# EAGLE design remote (EAGLE 9.1.0)
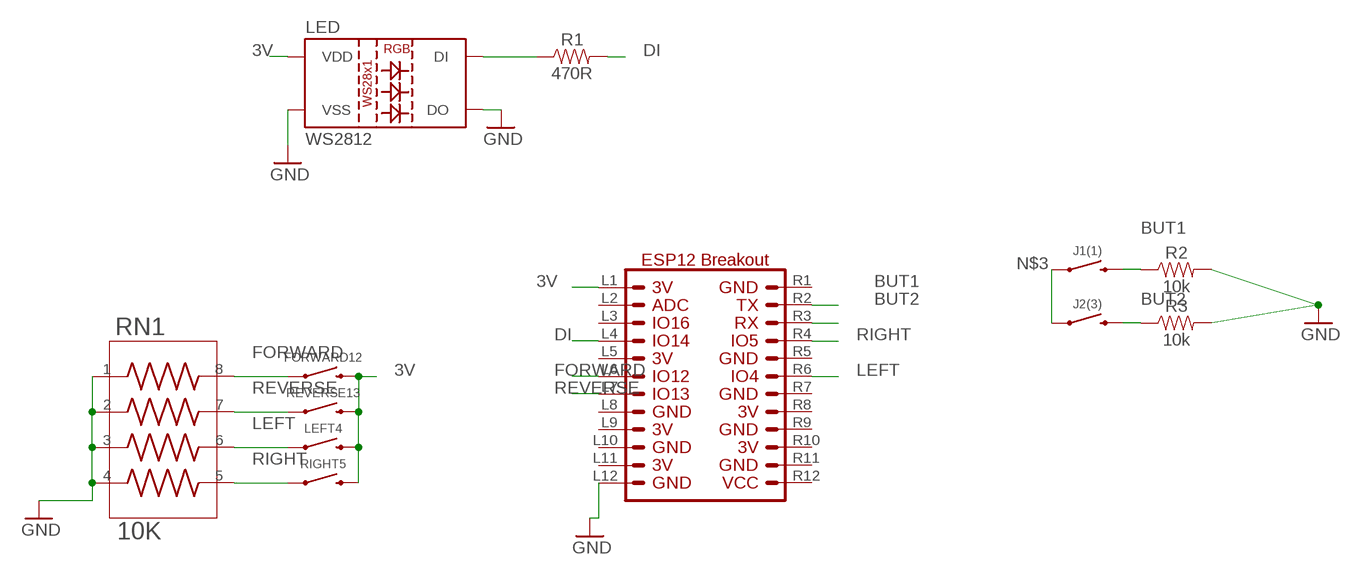
[diagram p0: schematic, sheet 1]

## Parts
FORWARD12  PUSHBUTTON_THD  [TACTILE_SWITCH_PTH_6.0MM]
J1(1)  PUSHBUTTON_THD  [TACTILE_SWITCH_PTH_6.0MM]
J2(3)  PUSHBUTTON_THD  [TACTILE_SWITCH_PTH_6.0MM]
LED  WS2812  [LED-TRICOLOR-5050-IC]
LEFT4  PUSHBUTTON_THD  [TACTILE_SWITCH_PTH_6.0MM]
R1  470R  RESISTOR_1206  [SPARKFUN-RESISTORS_1206]
R2  10k  RESISTOR_1206  [SPARKFUN-RESISTORS_1206]
R3  10k  RESISTOR_1206  [SPARKFUN-RESISTORS_1206]
REVERSE13  PUSHBUTTON_THD  [TACTILE_SWITCH_PTH_6.0MM]
RIGHT5  PUSHBUTTON_THD  [TACTILE_SWITCH_PTH_6.0MM]
RN1  10K  RESISTOR_ARRAY_1206  [RESCAF80P320X160X60-8N]
U$1  ESP12_BREAKOUT  [ESP12_BREAKOUT_CONN]

## Nets
3V: FORWARD12.3 LED.VDD LEFT4.3 REVERSE13.3 RIGHT5.3 U$1.L1
BUT1: J1(1).3 R2.1 U$1.R2
BUT2: J2(3).3 R3.1 U$1.R3
DI: R1.2 U$1.L4
FORWARD: FORWARD12.1 RN1.8 U$1.L6
GND: LED.DOUT(DO) LED.VSS R2.2 R3.2 RN1.1 RN1.2 RN1.3 RN1.4 U$1.L12
LEFT: LEFT4.1 RN1.6 U$1.R6
N$3: J1(1).1 J2(3).1
N$6: LED.DIN(DI) R1.1
REVERSE: REVERSE13.1 RN1.7 U$1.L7
RIGHT: RIGHT5.1 RN1.5 U$1.R4
Unconnected: U$1.L2 U$1.L3 U$1.L5 U$1.L8 U$1.L9 U$1.L10 U$1.L11 U$1.R1 U$1.R5 U$1.R7 U$1.R8 U$1.R9 U$1.R10 U$1.R11 U$1.R12

## Library data of the parts
FORWARD12 J1(1) J2(3) LEFT4 REVERSE13 RIGHT5 = AutoPark:PUSHBUTTON_THD
LED = AutoPark:WS2812
R1-R3 = AutoPark:RESISTOR_1206
RN1 = AutoPark:RESISTOR_ARRAY_1206: Res Thick Film Array 75 Ohm 5% 0.25W(1/4W) ?200ppm/C ISOL Molded 8-Pin 1206(4 X 0603) Convex SMD T/R; AVAILABILITY: Unavailable; DESCRIPTION: Res Thick Film Array 75 Ohm 5% 0.25W_1/4W_ ?200ppm/C ISOL Molded 8-Pin 1206_4 X 0603_ Convex SMD T/R; MF: Bourns; MP: CAY16-750J4LF; PACKAGE: 1206 Bourns; PRICE: None
U$1 = AutoPark:ESP12_BREAKOUT

## Board
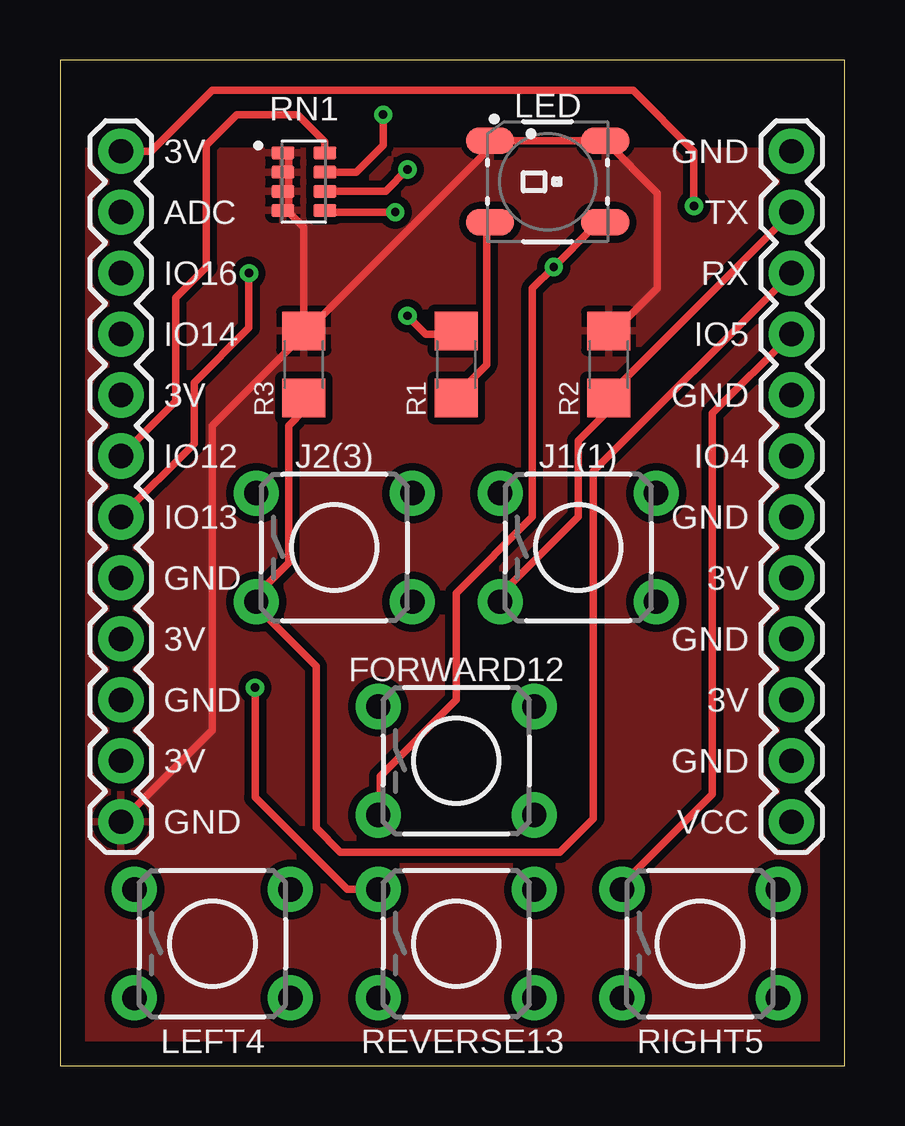
[diagram p1: board, top side]
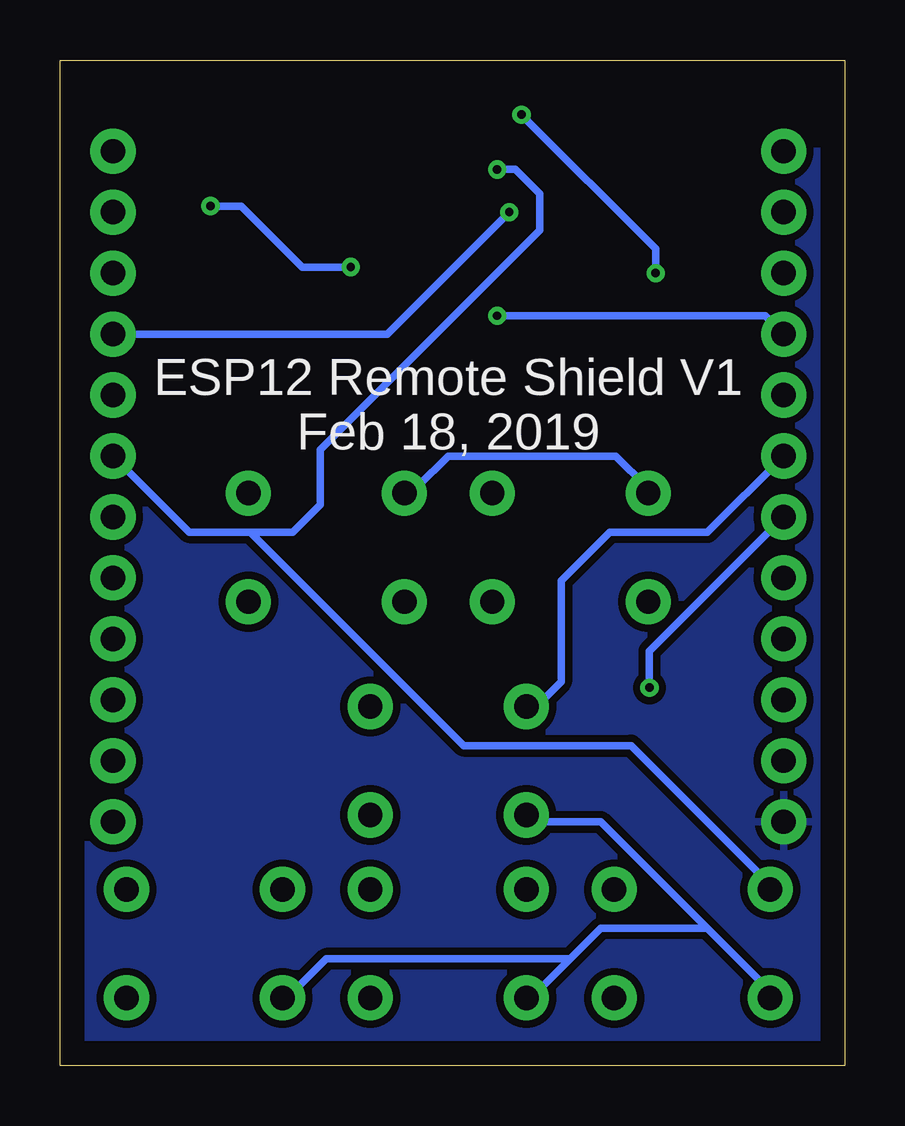
[diagram p2: board, bottom side, seen from below]

Size 32.69 x 41.9 mm. Coordinates in mm from the lower left corner, seen from the top.
Outline: 0,0 32.69,0 32.69,41.9 0,41.9 0,0
Copper layers (1*16): Top 0.035mm / dielectric 1.5mm / Bottom 0.035mm
Design rules "default *": minimum track width 12mil, minimum drill 0.35mm, track to track 6mil, track to pad 6mil, pad to pad 6mil, via to via 6mil, smd to smd 6mil, copper to edge 40mil, drill to drill 6mil, minimum pad ring 10mil, minimum via ring 8mil, stop-mask expansion 4mil, vias tented up to drill 15mil, thermal gap 10mil

### Footprints (pad centres in the part's own frame; a part is rotated, then mirrored left to right if it is on the bottom)
TACTILE_SWITCH_PTH_6.0MM = drill 1.016 pad 1.88: 1 -3.251,2.261; 2 3.251,2.261; 3 -3.251,-2.261; 4 3.251,-2.261
LED-TRICOLOR-5050-IC = smd 2 x 1.1: DIN -2.4,-1.7; DOUT 2.4,1.7; VDD 2.4,-1.7; VSS -2.4,1.7
SPARKFUN-RESISTORS_1206 = smd 1.6 x 1.8: 1 -1.4,0; 2 1.4,0
RESCAF80P320X160X60-8N = smd 0.97 x 0.53: 1 -0.875,1.2; 2 -0.875,0.4; 3 -0.875,-0.4; 4 -0.875,-1.2; 5 0.875,-1.2; 6 0.875,-0.4; 7 0.875,0.4; 8 0.875,1.2
ESP12_BREAKOUT_CONN = drill 1.016 pad 1.88: L1 1.27,29.21; L2 1.27,26.67; L3 1.27,24.13; L4 1.27,21.59; L5 1.27,19.05; L6 1.27,16.51; L7 1.27,13.97; L8 1.27,11.43; L9 1.27,8.89; L10 1.27,6.35; L11 1.27,3.81; L12 1.27,1.27; R1 29.21,29.21; R2 29.21,26.67; R3 29.21,24.13; R4 29.21,21.59; R5 29.21,19.05; R6 29.21,16.51; R7 29.21,13.97; R8 29.21,11.43; R9 29.21,8.89; R10 29.21,6.35; R11 29.21,3.81; R12 29.21,1.27

### Placement (x,y rotation side)
FORWARD12  16.51,12.7 0 top
J1(1)  21.59,21.59 0 top
J2(3)  11.43,21.59 0 top
LED  20.32,36.83 0 top
LEFT4  6.35,5.08 0 top
R1  16.51,29.21 90 top
R2  22.86,29.21 90 top
R3  10.16,29.21 90 top
REVERSE13  16.51,5.08 0 top
RIGHT5  26.67,5.08 0 top
RN1  10.16,36.83 0 top
U$1  1.27,8.89 0 top

### Tracks (layer width: path | path; a pad name or v marks a point on that pad's centre or on a via)
3V  (via drill 0.35)
  Top 0.305: LED.VDD 22.22,34.92 v20.57,33.27 19.68,32.38 19.68,22.86 16.51,19.69 16.51,15.24 13.34,12.06 13.34,10.79 FORWARD12.3 | U$1.L1 3.81,38.1 6.35,40.64 23.88,40.64 26.42,38.1 v26.42,35.81
  Bottom 0.305: 5.71,5.71 10.16,10.16 12.7,10.16 FORWARD12.3 | 5.71,5.71 3.17,3.18 LEFT4.3 | 11.43,4.45 10.16,5.71 5.71,5.71 | 11.43,4.45 12.7,3.18 REVERSE13.3 | 11.43,4.45 21.59,4.45 22.86,3.18 RIGHT5.3 | v26.42,35.81 25.15,35.81 22.61,33.27 v20.57,33.27
BUT1
  Top 0.305: U$1.R2 22.86,27.94 R2.1 22.86,27.3 21.59,26.03 21.59,22.86 18.41,19.69 J1(1).3
BUT2
  Top 0.305: R3.1 10.16,27.3 9.52,26.67 9.52,20.95 8.25,19.69 J2(3).3 8.25,19.05 10.67,16.64 10.67,9.91 11.68,8.89 20.83,8.89 22.22,10.29 22.22,24.77 U$1.R3
DI  (via drill 0.35)
  Top 0.305: R1.2 16.51,30.48 15.24,30.48 v14.48,31.24
  Bottom 0.305: v14.48,31.24 3.3,31.24 U$1.L4
FORWARD
  Top 0.305: U$1.L6 4.83,27.69 4.83,32 6.1,33.27 6.1,38.35 7.37,39.62 9.91,39.62 11.04,38.49 RN1.8
  Bottom 0.305: U$1.L6 5.71,22.23 9.78,22.23 11.81,20.19 11.81,16 12.85,14.96 FORWARD12.1
GND
  Top 0.305: 9.52,36.2 9.52,35.56 | 9.52,37.46 9.52,38.1 RN1.1 | 9.52,37.46 9.52,36.2 | 9.52,36.2 RN1.3 | 9.52,37.46 RN1.2 | 9.52,35.56 10.16,34.92 R3.2 10.16,30.48 | 9.52,35.56 RN1.4 | U$1.L12 6.35,13.97 6.35,26.67 10.16,30.48 | 10.16,30.48 17.78,38.1 LED.VSS LED.DOUT 24.89,36.36 24.89,32.38 23.12,30.61 R2.2
  pour Top (isolate 0.305): 0.13,38.1 32.64,38.1 32.64,0 0,0 0,38.1
  pour Bottom (isolate 0.305): 0,38.1 32.77,38.1 32.77,0 32.64,0 0,0
LEFT  (via drill 0.35)
  Top 0.305: RN1.6 13.57,36.43 v14.48,37.34
  Bottom 0.305: 24.77,22.23 15.88,13.34 8.89,13.34 3.17,7.62 LEFT4.1 | 24.77,22.23 27.3,22.23 U$1.R6 | 24.77,22.23 22.99,22.23 21.84,23.37 21.84,25.65 12.7,34.8 12.7,36.32 13.72,37.34 v14.48,37.34
N$3
  Bottom 0.305: J2(3).1 8.25,24.13 9.52,25.4 16.51,25.4 17.78,24.13 J1(1).1
N$6
  Top 0.305: R1.1 16.51,27.94 17.78,29.21 17.78,34.92 LED.DIN
REVERSE  (via drill 0.35)
  Top 0.305: RN1.7 12.34,37.23 13.46,38.35 v13.46,39.62 | v7.87,33.02 7.87,30.73 5.59,28.45 5.59,25.91 U$1.L7 | v8.13,15.75 8.13,11.18 11.96,7.34 REVERSE13.1
  Bottom 0.305: v13.46,39.62 7.87,34.04 v7.87,33.02 | U$1.L7 8.13,17.27 v8.13,15.75
RIGHT  (via drill 0.35)
  Top 0.305: v13.97,35.56 11.43,35.56 RN1.5 | U$1.R4 27.18,27.18 27.18,11.3 23.49,7.62 RIGHT5.1
  Bottom 0.305: v13.97,35.56 19.05,30.48 U$1.R4

### Text on the board
bPlace: ESP12 Remote Shield V1 / Feb 18, 2019